# Altium schematic sheet 01_overview.SchDoc: foxBMS BMS-Interface
size A3; DocumentNumber: 1; SheetNumber: 1; SheetTotal: 6; Author: Fraunhofer IISB foxBMS Team; REL-DATE: 2017-05-09; VERSION: 1.1.0; GateName_1: G$1; SymbolName_1: FRAME_B_L; LibraryName: foxBMS_BMS-Master_V1.00_A; DeviceSetName: FRAME_B_L; GateName_2: G$2; SymbolName_2: DOCFIELD; SheetDescription: Structure of Interface
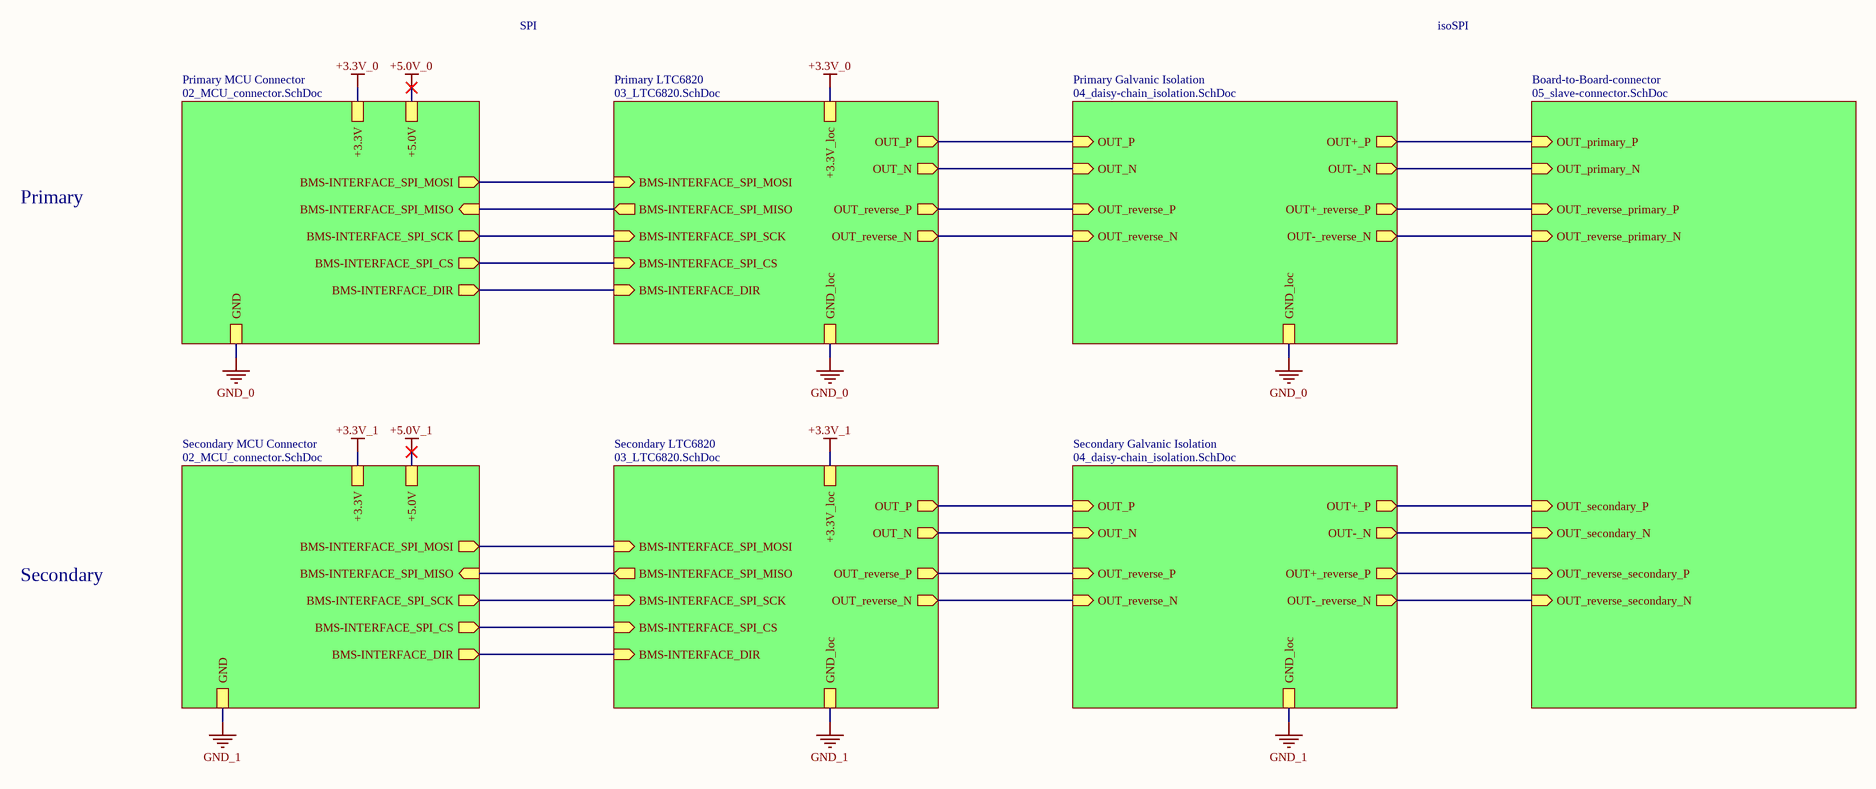
[diagram p0: 01_overview.SchDoc]

## Sub-sheets
Board-to-Board-connector = 05_slave-connector.SchDoc: OUT_secondary_N (in), OUT_secondary_P (in), OUT_primary_P (in), OUT_reverse_primary_N (in), OUT_primary_N (in), OUT_reverse_primary_P (in), OUT_reverse_secondary_P (in), OUT_reverse_secondary_N (in)
Primary Galvanic Isolation = 04_daisy-chain_isolation.SchDoc: OUT_P (in), OUT_N (in), OUT+_P (out), OUT-_N (out), GND_loc, OUT_reverse_N (in), OUT_reverse_P (in), OUT+_reverse_P (out), OUT-_reverse_N (out)
Primary LTC6820 = 03_LTC6820.SchDoc: BMS-INTERFACE_SPI_CS (in), BMS-INTERFACE_SPI_SCK (in), BMS-INTERFACE_SPI_MOSI (in), BMS-INTERFACE_SPI_MISO (out), OUT_P (out), OUT_N (out), +3.3V_loc, GND_loc, OUT_reverse_P (out), OUT_reverse_N (out), BMS-INTERFACE_DIR (in)
Primary MCU Connector = 02_MCU_connector.SchDoc: GND, +3.3V, +5.0V, BMS-INTERFACE_SPI_MOSI (out), BMS-INTERFACE_SPI_MISO (in), BMS-INTERFACE_SPI_SCK (out), BMS-INTERFACE_SPI_CS (out), BMS-INTERFACE_DIR (out)
Secondary Galvanic Isolation = 04_daisy-chain_isolation.SchDoc: OUT+_P (out), OUT-_N (out), OUT_P (in), OUT_N (in), GND_loc, OUT_reverse_P (in), OUT_reverse_N (in), OUT+_reverse_P (out), OUT-_reverse_N (out)
Secondary LTC6820 = 03_LTC6820.SchDoc: BMS-INTERFACE_SPI_CS (in), BMS-INTERFACE_SPI_MOSI (in), BMS-INTERFACE_SPI_MISO (out), BMS-INTERFACE_SPI_SCK (in), OUT_N (out), OUT_P (out), +3.3V_loc, GND_loc, OUT_reverse_P (out), OUT_reverse_N (out), BMS-INTERFACE_DIR (in)
Secondary MCU Connector = 02_MCU_connector.SchDoc: GND, +3.3V, +5.0V, BMS-INTERFACE_SPI_MOSI (out), BMS-INTERFACE_SPI_MISO (in), BMS-INTERFACE_SPI_SCK (out), BMS-INTERFACE_SPI_CS (out), BMS-INTERFACE_DIR (out)

## Nets
+3.3V_0: sheet Primary LTC6820/+3.3V_loc, sheet Primary MCU Connector/+3.3V
+3.3V_1: sheet Secondary LTC6820/+3.3V_loc, sheet Secondary MCU Connector/+3.3V
+5.0V_0: sheet Primary MCU Connector/+5.0V
+5.0V_1: sheet Secondary MCU Connector/+5.0V
GND_0: sheet Primary LTC6820/GND_loc, sheet Primary Galvanic Isolation/GND_loc, sheet Primary MCU Connector/GND
GND_1: sheet Secondary LTC6820/GND_loc, sheet Secondary Galvanic Isolation/GND_loc, sheet Secondary MCU Connector/GND
(unnamed): sheet Primary LTC6820/BMS-INTERFACE_SPI_CS, sheet Primary MCU Connector/BMS-INTERFACE_SPI_CS
(unnamed): sheet Primary LTC6820/BMS-INTERFACE_SPI_SCK, sheet Primary MCU Connector/BMS-INTERFACE_SPI_SCK
(unnamed): sheet Primary LTC6820/BMS-INTERFACE_SPI_MOSI, sheet Primary MCU Connector/BMS-INTERFACE_SPI_MOSI
(unnamed): sheet Primary LTC6820/BMS-INTERFACE_SPI_MISO, sheet Primary MCU Connector/BMS-INTERFACE_SPI_MISO
(unnamed): sheet Primary LTC6820/OUT_P, sheet Primary Galvanic Isolation/OUT_P
(unnamed): sheet Primary LTC6820/OUT_N, sheet Primary Galvanic Isolation/OUT_N
(unnamed): sheet Primary LTC6820/OUT_reverse_P, sheet Primary Galvanic Isolation/OUT_reverse_P
(unnamed): sheet Primary LTC6820/OUT_reverse_N, sheet Primary Galvanic Isolation/OUT_reverse_N
(unnamed): sheet Primary LTC6820/BMS-INTERFACE_DIR, sheet Primary MCU Connector/BMS-INTERFACE_DIR
(unnamed): sheet Primary Galvanic Isolation/OUT+_P, sheet Board-to-Board-connector/OUT_primary_P
(unnamed): sheet Primary Galvanic Isolation/OUT-_N, sheet Board-to-Board-connector/OUT_primary_N
(unnamed): sheet Primary Galvanic Isolation/OUT+_reverse_P, sheet Board-to-Board-connector/OUT_reverse_primary_P
(unnamed): sheet Primary Galvanic Isolation/OUT-_reverse_N, sheet Board-to-Board-connector/OUT_reverse_primary_N
(unnamed): sheet Secondary LTC6820/BMS-INTERFACE_SPI_CS, sheet Secondary MCU Connector/BMS-INTERFACE_SPI_CS
(unnamed): sheet Secondary LTC6820/BMS-INTERFACE_SPI_MOSI, sheet Secondary MCU Connector/BMS-INTERFACE_SPI_MOSI
(unnamed): sheet Secondary LTC6820/BMS-INTERFACE_SPI_MISO, sheet Secondary MCU Connector/BMS-INTERFACE_SPI_MISO
(unnamed): sheet Secondary LTC6820/BMS-INTERFACE_SPI_SCK, sheet Secondary MCU Connector/BMS-INTERFACE_SPI_SCK
(unnamed): sheet Secondary LTC6820/OUT_N, sheet Secondary Galvanic Isolation/OUT_N
(unnamed): sheet Secondary LTC6820/OUT_P, sheet Secondary Galvanic Isolation/OUT_P
(unnamed): sheet Secondary LTC6820/OUT_reverse_P, sheet Secondary Galvanic Isolation/OUT_reverse_P
(unnamed): sheet Secondary LTC6820/OUT_reverse_N, sheet Secondary Galvanic Isolation/OUT_reverse_N
(unnamed): sheet Secondary LTC6820/BMS-INTERFACE_DIR, sheet Secondary MCU Connector/BMS-INTERFACE_DIR
(unnamed): sheet Secondary Galvanic Isolation/OUT+_P, sheet Board-to-Board-connector/OUT_secondary_P
(unnamed): sheet Secondary Galvanic Isolation/OUT-_N, sheet Board-to-Board-connector/OUT_secondary_N
(unnamed): sheet Secondary Galvanic Isolation/OUT+_reverse_P, sheet Board-to-Board-connector/OUT_reverse_secondary_P
(unnamed): sheet Secondary Galvanic Isolation/OUT-_reverse_N, sheet Board-to-Board-connector/OUT_reverse_secondary_N

## Notes on the sheet
- SPI
- isoSPI
- Primary
- Secondary
- Fraunhofer IISB
- Schottkystr. 10
- developed by:
- 91058 Erlangen
- Germany
- Author
- Project
- License
- Description
- File
- Version
- Release Date
- Sheet
- www.foxbms.org
- www.iisb.fraunhofer.de
- foxBMS Team
- /